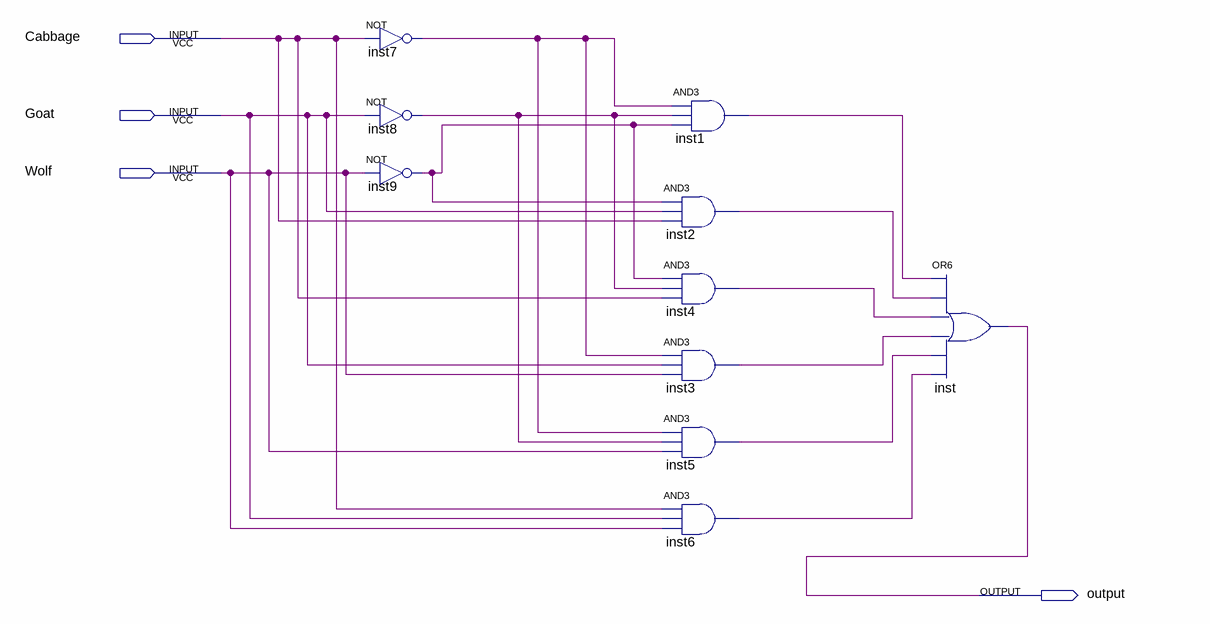
[diagram p0: schematic sheet]
// Quartus schematic lab2step2.bdf as structural Verilog: 10 symbols, 4 pins
module lab2step2 (
  input  Cabbage,
  input  Goat,
  input  Wolf,
  output \output 
);

  wire inst1_out, inst2_out, inst3_out, inst4_out, inst5_out, inst6_out, inst7_out, inst8_out, inst9_out;

  not inst7 (inst7_out, Cabbage);
  not inst8 (inst8_out, Goat);
  not inst9 (inst9_out, Wolf);
  and inst1 (inst1_out, inst7_out, inst8_out, inst9_out);
  and inst2 (inst2_out, inst9_out, Goat, Cabbage);
  and inst4 (inst4_out, inst9_out, inst8_out, Cabbage);
  and inst3 (inst3_out, inst7_out, Goat, Wolf);
  and inst5 (inst5_out, inst7_out, inst8_out, Wolf);
  and inst6 (inst6_out, Cabbage, Goat, Wolf);
  or inst (\output , inst1_out, inst2_out, inst4_out, inst3_out, inst5_out, inst6_out);
endmodule
